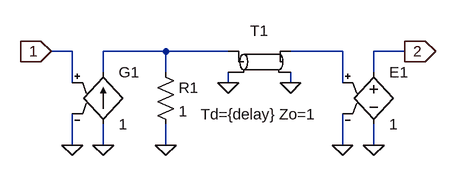
[diagram p0: schematic Delay.asc]
Delay.asc, the LTspice schematic file:
Version 4
SHEET 1 1836 784
WIRE 640 -256 688 -256
WIRE 176 -112 176 -160
WIRE 224 -112 224 -144
WIRE 224 -256 320 -256
WIRE 416 -224 416 -208
WIRE 512 -224 512 -208
WIRE 320 -256 416 -256
WIRE 224 -224 224 -256
WIRE 320 -112 320 -144
WIRE 320 -224 320 -256
WIRE 592 -160 592 -112
WIRE 640 -112 640 -144
WIRE 640 -224 640 -256
WIRE 144 -256 176 -256
WIRE 176 -256 176 -208
WIRE 512 -256 592 -256
WIRE 592 -256 592 -208
FLAG 144 -256 1
IOPIN 144 -256 In
FLAG 688 -256 2
IOPIN 688 -256 Out
FLAG 176 -112 0
FLAG 224 -112 0
FLAG 416 -208 0
FLAG 320 -112 0
FLAG 592 -112 0
FLAG 640 -112 0
FLAG 512 -208 0
SYMBOL tline 464 -240 R0
WINDOW 0 0 -32 Bottom 0
WINDOW 3 0 65 Top 0
SYMATTR InstName T1
SYMATTR Value Td={delay} Zo=1
SYMBOL g 224 -240 R0
SYMATTR InstName G1
SYMATTR Value 1
SYMBOL res 304 -240 R0
SYMATTR InstName R1
SYMATTR Value 1
SYMBOL e 640 -240 R0
SYMATTR InstName E1
SYMATTR Value 1

The netlist it stands for:
* Delay.asc
T1 N001 0 N002 0 Td={delay} Zo=1
G1 0 N001 1 0 1
R1 N001 0 1
E1 2 0 N002 0 1
.backanno
.end